# Altium schematic sheet STM32RF_PowerUSBSchDoc.SchDoc
size A4; SheetNumber: 3; SheetTotal: 5
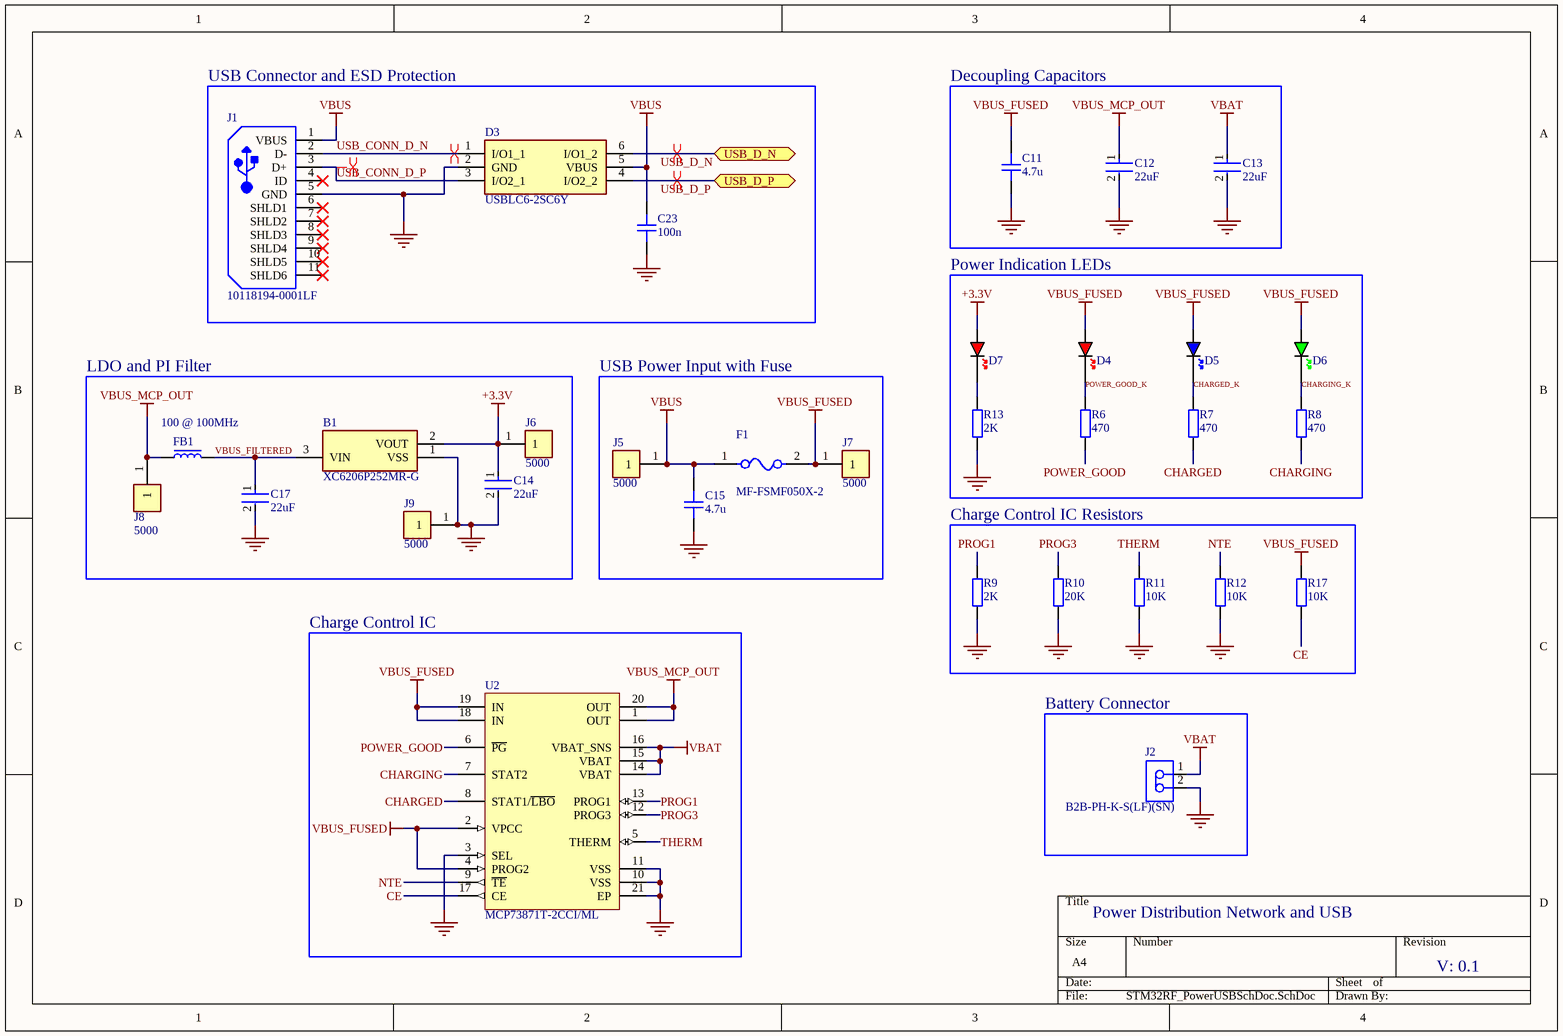
[diagram p0: STM32RF_PowerUSBSchDoc.SchDoc]

## Parts
B1  XC6206P252MR-G  [SOT95P280X130-3N]
C11  4.7u  [CAP_0402]
C12  22uF  [FP-GRM158-0_2-MFG]
C13  22uF  [FP-GRM158-0_2-MFG]
C14  22uF  [FP-GRM158-0_2-MFG]
C15  4.7u  [CAP_0402]
C17  22uF  [FP-GRM158-0_2-MFG]
C23  100n  [CAP_0402]
D3  USBLC6-2SC6Y  [SOT95P280X145-6N]
D4  RED  [LED_0402_RED]  (value not drawn)
D5  BLUE  [LED_0402_BLUE]  (value not drawn)
D6  GREEN  [LED_0402_GREEN]  (value not drawn)
D7  RED  [LED_0402_RED]  (value not drawn)
F1  MF-FSMF050X-2  [FP-MF-FSMF-MFG]
FB1  100 @ 100MHz  [FB_0603]
J1  10118194-0001LF  [FCI-10118194-0001LF-5_V]
J2  B2B-PH-K-S(LF)(SN)  [JST-B2B-PH-K-S_V]
J5  5000  [FP-5000-MFG]
J6  5000  [FP-5000-MFG]
J7  5000  [FP-5000-MFG]
J8  5000  [FP-5000-MFG]
J9  5000  [FP-5000-MFG]
R6  470  [RES_0402]
R7  470  [RES_0402]
R8  470  [RES_0402]
R9  2K  [RES_0402]
R10  20K  [RES_0402]
R11  10K  [RES_0402]
R12  10K  [RES_0402]
R13  2K  [RES_0402]
R17  10K  [RES_0402]
U2  MCP73871T-2CCI/ML  [QFN-ML20_L]

## Blocks framed on the sheet
USB Connector and ESD Protection: C23 D3 J1
Decoupling Capacitors: C11-C13
Power Indication LEDs: D4-D7 R6-R8 R13
LDO and PI Filter: B1 C14 C17 FB1 J6 J8 J9
USB Power Input with Fuse: C15 F1 J5 J7
Charge Control IC Resistors: R9-R12 R17
Charge Control IC: U2
Battery Connector: J2

## Ports
USB_D_N (bidir, see STM32RF_TopLevel[2B], STM32RF_MCU[1B]), USB_D_P (bidir, see STM32RF_TopLevel[2B], STM32RF_MCU[1B])

## Nets
+3.3V: B1.2(VOUT) C14.1 D7.A J6.1
GND: B1.1(VSS) C11.1 C12.2 C13.2 C14.2 C15.1 C17.2 C23.1 D3.2(GND) J1.5(GND) J2.2 J9.1 R9.1 R10.1 R11.1 R12.1 R13.1 U2.3(SEL) U2.10(VSS) U2.11(VSS) U2.21(EP)
VBAT: C13.1 J2.1 U2.14(VBAT) U2.15(VBAT) U2.16(VBAT_SNS)
VBUS: C15.2 C23.2 D3.5(VBUS) F1.1 J1.1(VBUS) J5.1
VBUS_FUSED: C11.2 D4.A D5.A D6.A F1.2 J7.1 R17.2 U2.2(VPCC) U2.4(PROG2) U2.18(IN) U2.19(IN)
VBUS_MCP_OUT: C12.1 FB1.1 J8.1 U2.1(OUT) U2.20(OUT)
CE: R17.1 U2.17(CE)
CHARGED: R7.1 U2.8(STAT1/~{LBO})
CHARGED_K: D5.K R7.2
CHARGING: R8.1 U2.7(STAT2)
CHARGING_K: D6.K R8.2
NTE: R12.2 U2.9(~{TE})
POWER_GOOD: R6.1 U2.6(~{PG})
POWER_GOOD_K: D4.K R6.2
PROG1: R9.2 U2.13(PROG1)
PROG3: R10.2 U2.12(PROG3)
THERM: R11.2 U2.5(THERM)
USB_CONN_D_N: D3.1(I/O1_1) J1.2(D-)
USB_CONN_D_P: D3.3(I/O2_1) J1.3(D+)
USB_D_N: D3.6(I/O1_2) ; port USB_D_N
USB_D_P: D3.4(I/O2_2) ; port USB_D_P
VBUS_FILTERED: B1.3(VIN) C17.1 FB1.2
NetD7_K: D7.K R13.2

Not connected (* = marked no-connect by the designer): J1 4(ID)* 6(SHLD1)* 7(SHLD2)* 8(SHLD3)* 9(SHLD4)* 10(SHLD5)* 11(SHLD6)*

## Layout directives
differential pair: USB_CONN_D_N, USB_CONN_D_P, USB_D_N, USB_D_P

## Notes on the sheet
- Power Distribution Network and USB
- V: 0.1

## Library data of the parts
B1 = XC6206P252MR-G: LDO Voltage Regulators 1uA Low Quiescent 3 Terminal, Low ESR Cap. Compatible, Voltage Regulator; Manufacturer_Name: Torex; Geometry.Height: 1.3mm; Manufacturer_Part_Number: XC6206P252MR-G; Mouser Part Number: 865-XC6206P252MR-G; Mouser Price/Stock: https://www.mouser.co.uk/ProductDetail/Torex-Semiconductor/XC6206P252MR-G?qs=AsjdqWjXhJ%2FThrLMef8qfg%3D%3D; Arrow Part Number: *; Arrow Price/Stock: *; Datasheet Link: https://www.torexsemi.com/file/xc6206/XC6206.pdf
C11 C15 C23 = CAP_0402: Capacitor SMD 0402; Manufacturer: Murata Electronics; Manufacturer Part Number: GRM155R61E475ME15D; Distributor Link: *; LCSC: *; Rating: *; Dielectric: *
C12-C14 C17 = CMP-06035-020400-1: Chip Multilayer Ceramic Capacitors for General Purpose, 0402, 22uF, X5R, 15%, 20%, 10V
D3 = USBLC6-2SC6Y: Low Cap. ESD Protection Auto SOT-23-6 STMicroelectronics USBLC6-2SC6Y, Dual Uni-Directional TVS Diode Array, 6-Pin SOT-23; Geometry.Height: 1.45mm; Manufacturer_Name: STMicroelectronics; Manufacturer_Part_Number: USBLC6-2SC6Y; Mouser Part Number: 511-USBLC6-2SC6Y; Mouser Price/Stock: https://www.mouser.co.uk/ProductDetail/STMicroelectronics/USBLC6-2SC6Y?qs=gNDSiZmRJS%2FOgDexvXkdow%3D%3D; Arrow Part Number: USBLC6-2SC6Y; Arrow Price/Stock: https://www.arrow.com/en/products/usblc6-2sc6y/stmicroelectronics?utm_currency=USD&region=nac; Datasheet Link: https://www.st.com/resource/en/datasheet/usblc6-2sc6y.pdf
D4 D7 = LED_0402_RED: LED 0402 RED SMD
D5 = LED_0402_BLUE: LED 0402 BLUE SMD
D6 = LED_0402_GREEN: LED 0402 GREEN SMD
F1 = CMP-07400-000010-1: PTC RESET FUSE 6V 500MA 0603; Manufacturer: Bourns Inc.; Trip Current: 1A; Current Rating: 40A; Hold Current: 0.5A; Resistance: 0.1-0.8Ω; Value: 0.1-0.8Ω; Trip Time: 0.1s; Mouser Description: Resettable Fuses - PPTC 6volts 40amps; Category: Fuse; Digikey Description: PTC RESET FUSE 6V 500MA 0603; Temperature: -40°C to +85°C; Device Class L3: unset; Automotive: No; RoHS: TRUE; Ambient Temperature Range High: +85°C; Device Class L2: PTC Resettable Fuses; Temperature Range High: +85°C; Voltage Rating: 6V; Package: MF-FSMF; Manufacturer Part Number: MF-FSMF050X-2; Ambient Temperature Range Low: -40°C; Lead Free: Yes; ComponentLink2Description: Datasheet; Octopart: https://octopart.com/mf-fsmf050x-2-bourns-10470804; ComponentLink2URL: https://www.bourns.com/docs/Product-Datasheets/mffsmf.pdf; Temperature Range Low: -40°C; Height: 1mm; Device Class L1: Circuit Protection
FB1 = FB_0603: Ferrite Bead SMD 0603; Manufacturer: *; Manufacturer Part Number: *; Distributor Link: *; LCSC: *
J1 = CMP-2000-05120-1: Micro USB B Type Receptacle, 1.8 A, -55 to 85 degC, 5-Pin SMD, RoHS, Tape and Reel; Manufacturer: Amphenol FCI; Body Orientation: RightAngle; Number of Contacts: 5; Pitch: 0.65mm; Gender: RCP; Rad Hard: No; Package Reference: 10118194-0001LF-5; Mounting: SurfaceMount; Manufacturer URL: http://www.fci.com/; Packaging: CutTape; Datasheet URL: https://datasheet.ciiva.com/26945/getdatasheetpartid-418619-26945695.pdf; Termination Method: Solder; Package Description: 5-Pin Surface Mount Device, Body 8.05 x 5.53 mm, Pitch 0.65 mm; Type: MicroUSBTypeB; Datasheet Version: Rev. A, 10/2011
J2 = CMP-2000-05162-1: Male Header, Pitch 2 mm, 1 x 2 Position, Height 6 mm, Tail Length 3.4 mm, -25 to 85 degC, RoHS, Bulk; Manufacturer: JST; Pitch: 2mm; Style/Orientation: StraightHeader/Plug; No of Positions: 2; Datasheet Version: Nov-08; Datasheet URL: http://datasheet.octopart.com/B2B-PH-K-S%28LF%29%28SN%29-JST-datasheet-8324864.pdf; Manufacturer URL: http://www.jst.com/home2.html; Type: ShroudedHeader; Termination: Crimp
J5-J9 = CMP-19636-000027-1: PC TEST POINT MINIATURE RED; Outside Diameter: 2.54mm; Body Material: Bronze; Number of Contacts: 1; Insulation: Insulated; Inside Diameter: 1.27mm; Hole Diameter: 1.6mm; Plating: Silver; Length: 7.62mm; Package Quantity: 100; Number of Ports: 1; Contact Material: Bronze; Orientation: Straight; RoHS Compliant: Yes; Housing Color: Red; Height: 0.3inch; Series: THM; Lead Free: Lead Free; Color: Red; Contact Plating: Tin; Mount: PCB; Packaging: Bulk; REACH SVHC: No SVHC; Flammability Rating: UL94 V-0; Material: Nylon
R6-R13 R17 = RES_0402: Resistor SMD 0402; Manufacturer: *; Manufacturer Part Number: *; Distributor Link: *; LCSC: *
U2 = CMP-0133-00007-1: Stand-Alone System Load Sharing and Li-Ion/Li-Polymer Battery Charge Management Controller, 4.35V, 20-Pin QFN, Industrial Temperature; PackageReference: QFN-ML20; PackageDescription: 20-Lead Plastic Quad Flat, No Lead Package (ML) - 4x4x0.9 mm Body [QFN]; PackageVersion: revBB, Aug-2009; DatasheetVersion: revB, May-2009